# EAGLE schematic electric_imp_breakout (EAGLE 6.2)
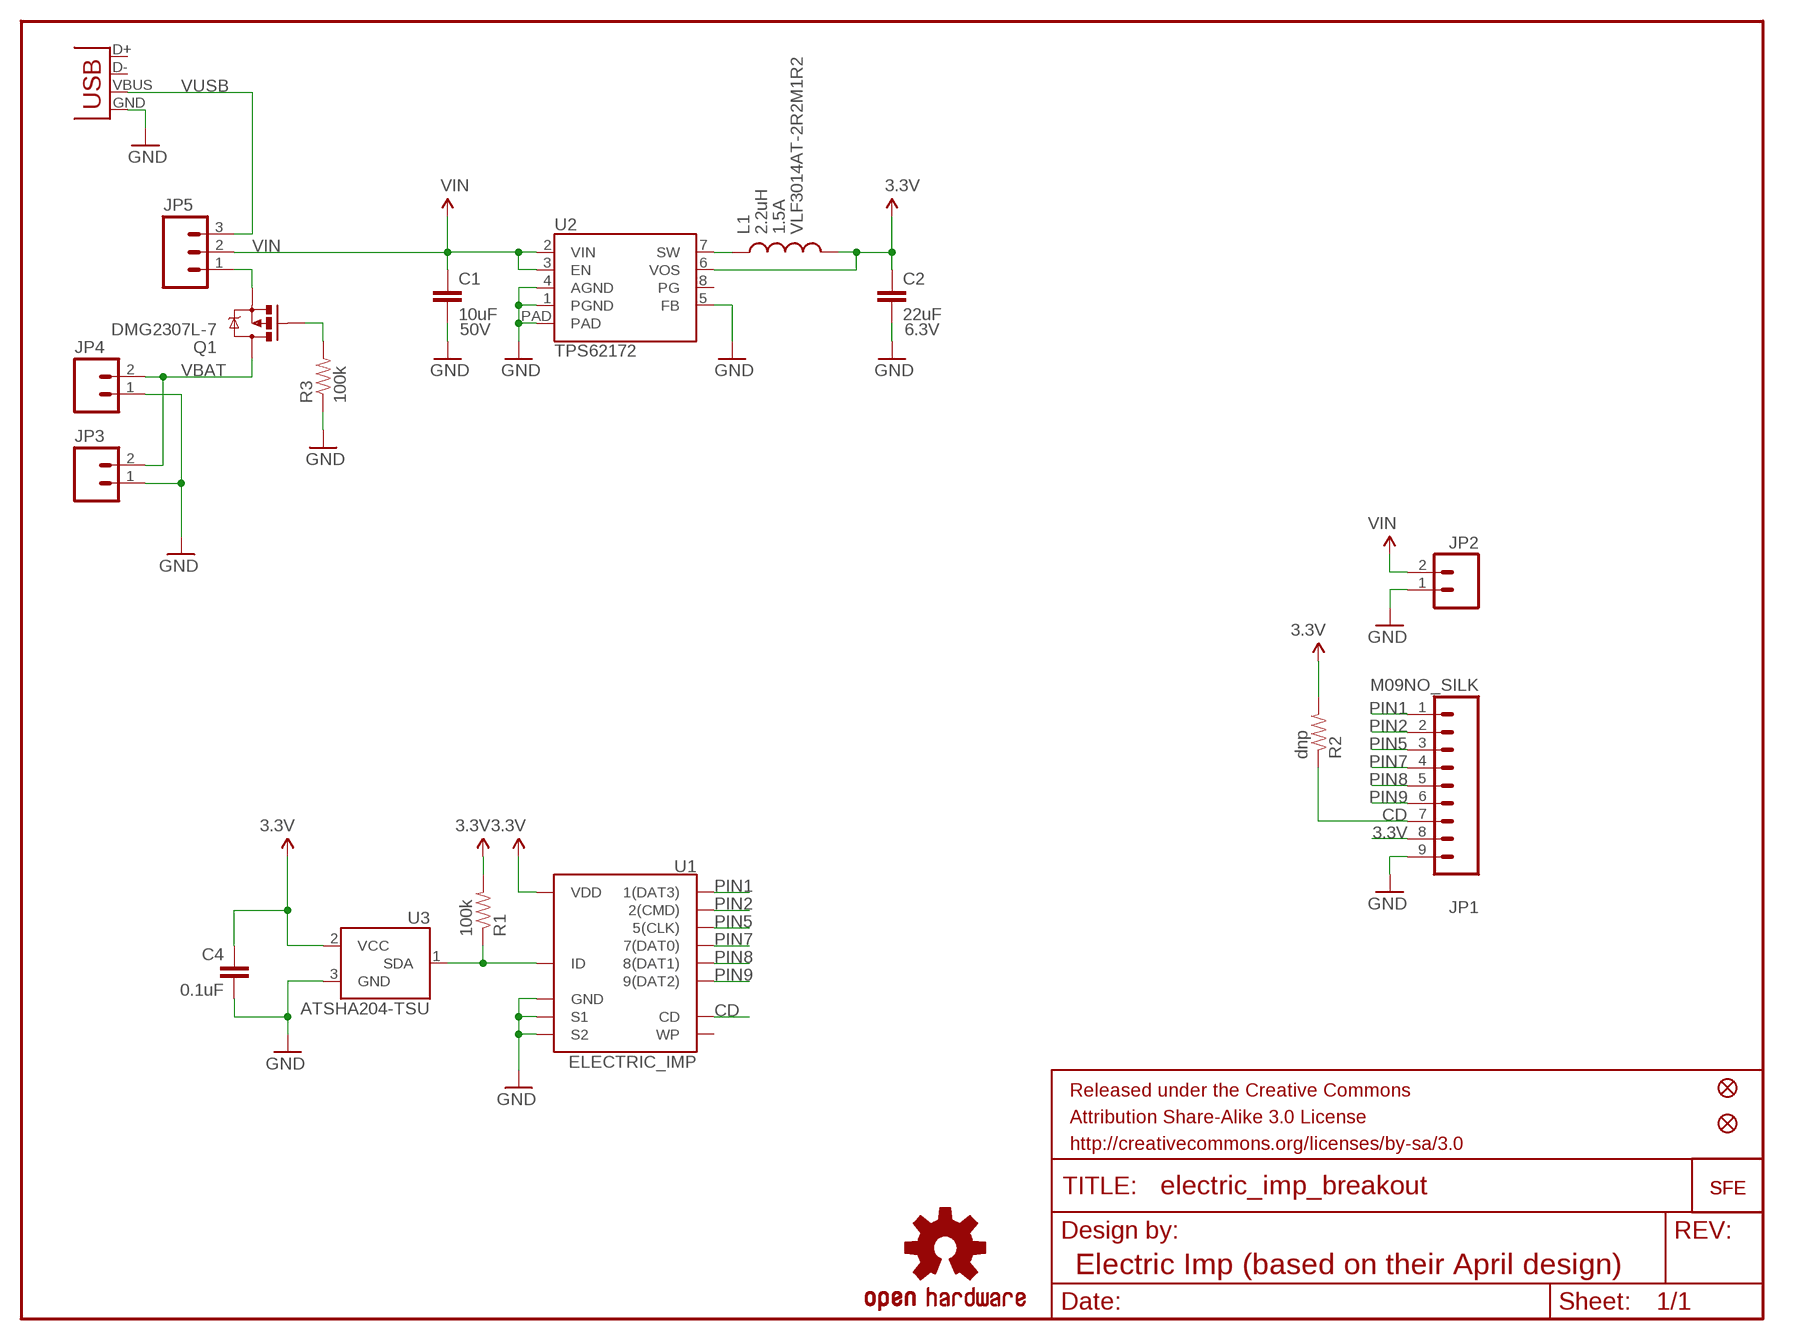
[diagram p0: schematic, sheet 1]

## Parts
C1  10uF  CAP1210  [1210]
C2  22uF  CAP0805  [0805]
C4  0.1uF  CAP0402-CAP  [0402-CAP]
JP1  M09NO_SILK  [1X09_NO_SILK]
JP2  M021X02_NO_SILK  [1X02_NO_SILK]
JP3  M02SMD  [1X02_SMD]
JP4  M02-JST-2-PTH-NO_SILK  [JST-2-PTH-NS]
JP5  M031X03_NO_SILK  [1X03_NO_SILK]
JP6  LOGO-SFESK  [SFE-LOGO-FLAME]
JP7  LOGO-SFENEW  [SFE-NEW-WEBLOGO]
JP8  FIDUCIALUFIDUCIAL  [MICRO-FIDUCIAL]
JP9  FIDUCIALUFIDUCIAL  [MICRO-FIDUCIAL]
L1  2.2uH  INDUCTORVLF4012A  [VLF4012A]
Q1  DMG2307L-7  MOSFET-PCHANNELSMD  [SOT23-3]
R1  100k  RESISTOR0402-RES  [0402-RES]
R2  dnp  RESISTOR0402-RES  [0402-RES]
R3  100k  RESISTOR0402-RES  [0402-RES]
U1  ELECTRIC_IMP  [SD_MMC_SOCKET]
U2  TPS62172  [WSON-8-PAD]
U3  ATSHA204-TSU  [SOT23-3]
U$5  OSHW-LOGOS  [OSHW-LOGO-S]
X1  USBSMD  [USB-MINIB]

## Nets
3.3V: C2.1 C4.1 JP1.8 L1.P$2 R1.2 R2.2 U1.4(VDD) U2.6(VOS) U3.2(VCC)
CD: JP1.7 R2.1 U1.CD
GND: C1.2 C2.2 C4.2 JP1.9 JP2.1 JP3.1 JP4.1 R3.1 U1.3(GND) U1.S1 U1.S2 U2.1(PGND) U2.4(AGND) U2.5(FB) U2.PAD U3.3(GND) X1.GND
ID: R1.1 U1.6(ID) U3.1(SDA)
N$1: L1.P$1 U2.7(SW)
N$2: Q1.1(G) R3.2
N$6: JP5.1 Q1.2(S)
PIN1: JP1.1 U1.1(1(DAT3))
PIN2: JP1.2 U1.2(2(CMD))
PIN5: JP1.3 U1.5(5(CLK))
PIN7: JP1.4 U1.7(7(DAT0))
PIN8: JP1.5 U1.8(8(DAT1))
PIN9: JP1.6 U1.9(9(DAT2))
VBAT: JP3.2 JP4.2 Q1.3(D)
VIN: C1.1 JP2.2 JP5.2 U2.2(VIN) U2.3(EN)
VUSB: JP5.3 X1.VBUS
Unconnected: U1.WP U2.8(PG) X1.D+ X1.D-

## Notes on the sheet
- 1.5A | VLF3014AT-2R2M1R2
- 50V | 6.3V
- Electric Imp (based on their April design)

## Library data of the parts
C1 C2 C4 = SparkFun-Passives:CAP: Capacitor Standard 0603 ceramic capacitor, and 0.1" leaded capacitor.
JP1 = SparkFun-Connectors:M09: Header 9 Standard 9-pin 0.1" header. Use with straight break away headers (SKU : PRT-00116), right angle break away headers (PRT-00553), swiss pins (PRT-00743), machine pins (PRT-00117), and female headers (PRT-00115).
JP2-JP4 = SparkFun-Connectors:M02: Header 2 Standard 2-pin 0.1" header. Use with straight break away headers (SKU : PRT-00116), right angle break away headers (PRT-00553), swiss pins (PRT-00743), machine pins (PRT-00117), and female headers (PRT-00115). Molex polarized connector foot print use with SKU : PRT-08233 with associated crimp pins and housings.
JP5 = SparkFun-Connectors:M03: Header 3 Standard 3-pin 0.1" header. Use with straight break away headers (SKU : PRT-00116), right angle break away headers (PRT-00553), swiss pins (PRT-00743), machine pins (PRT-00117), and female headers (PRT-00115). Molex polarized connector foot print use with SKU : PRT-08232 with associated crimp pins and housings.
JP6 JP7 = SparkFun-Aesthetics:LOGO-SFE: Spark Fun Electronics PCB Logo This is the standard Spark Fun Electronics PCB logo.
JP8 JP9 = SparkFun:FIDUCIAL: Fiducial Alignment Points Various fiducial points for machine vision alignment.
L1 = SparkFun-Passives:INDUCTOR: Inductors Basic Inductor/Choke - 0603 and 1206. Footprints are not proven and vary greatly between part numbers.
Q1 = SparkFun-DiscreteSemi:MOSFET-PCHANNEL: Generic PMOSFET
R1-R3 = SparkFun-Passives:RESISTOR: Resistor Basic schematic elements and footprints for 0603, 1206, and PTH resistors.
U1 = SparkFun-RF:ELECTRIC_IMP
U2 = SparkFun-PowerIC:TPS62172
U3 = SparkFun-DigitalIC:ATSHA204
U$5 = SparkFun-Aesthetics:OSHW-LOGO: Open Source Hardware Logo This logo indicates the piece of hardware it is found on incorporates a OSHW license and/or adheres to the definition of open source hardware found here: http://freedomdefined.org/OSHW
X1 = SparkFun-Connectors:USB: USB Connectors USB-B-PTH is fully proven SKU : PRT-00139 USB-miniB is fully proven SKU : PRT-00587 USB-A-PCB is untested. USB-A-H is throughly reviewed, but untested. Spark Fun Electronics SKU : PRT-00437 USB-B-SMT is throughly reviewed, but untested. Needs silkscreen touching up. USB-A-S has not been used/tested USB-MB-H has not been used/tested